# EAGLE schematic radio (EAGLE 7.5.0)
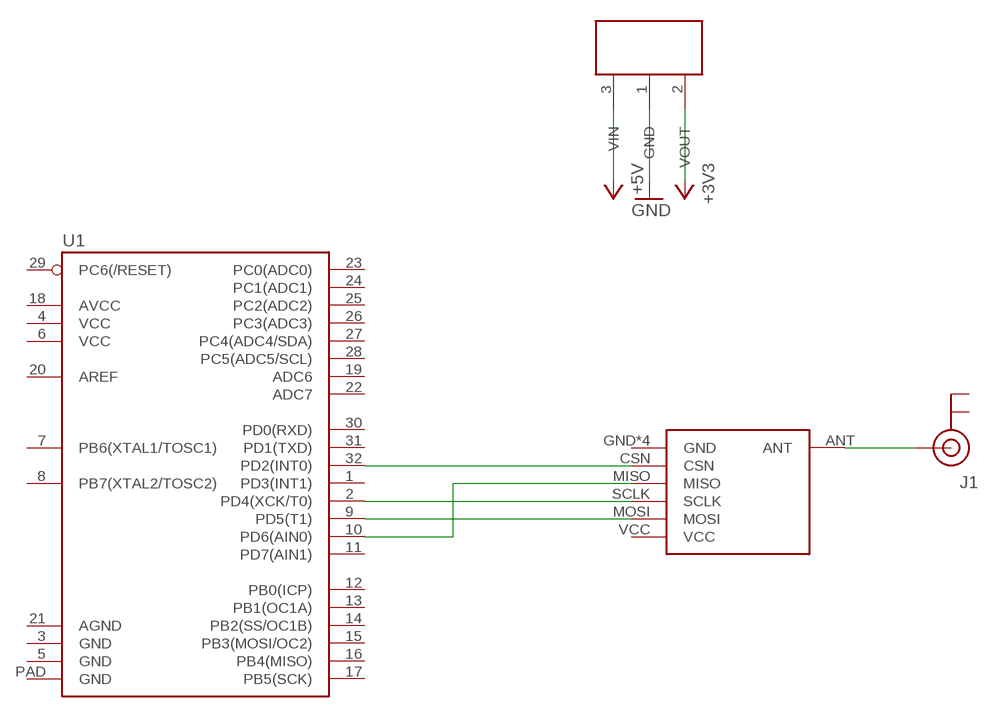
[diagram p0: schematic, sheet 1]

## Parts
J1  U.FL  [U.FL]
U1  ATMEGA328P_MLFMLF32  [MLF32-PAD]
U$1  CC2500-NOANT  [CC2500-SMD]
U$2  662K  [SOT-23]

## Nets
N$1: U1.2(PD4(XCK/T0)) U$1.SCLK
N$2: U1.32(PD2(INT0)) U$1.CSN
N$3: U1.9(PD5(T1)) U$1.MOSI
N$4: U1.10(PD6(AIN0)) U$1.MISO
N$5: J1.P$3(SIGNAL) U$1.ANT
Unconnected: J1.P$1(GND) J1.P$2(GND) U1.1(PD3(INT1)) U1.3(GND) U1.4(VCC) U1.5(GND) U1.6(VCC) U1.7(PB6(XTAL1/TOSC1)) U1.8(PB7(XTAL2/TOSC2)) U1.11(PD7(AIN1)) U1.12(PB0(ICP)) U1.13(PB1(OC1A)) U1.14(PB2(SS/OC1B)) U1.15(PB3(MOSI/OC2)) U1.16(PB4(MISO)) U1.17(PB5(SCK)) U1.18(AVCC) U1.19(ADC6) U1.20(AREF) U1.21(AGND) U1.22(ADC7) U1.23(PC0(ADC0)) U1.24(PC1(ADC1)) U1.25(PC2(ADC2)) U1.26(PC3(ADC3)) U1.27(PC4(ADC4/SDA)) U1.28(PC5(ADC5/SCL)) U1.29(PC6(/RESET)) U1.30(PD0(RXD)) U1.31(PD1(TXD)) U1.PAD(GND) U$1.GND U$1.GND@1(GND) U$1.GND@2(GND) U$1.GND@3(GND) U$1.VCC U$2.1(GND) U$2.2(VOUT) U$2.3(VIN)

## Library data of the parts
J1 = SparkFun-Connectors:U.FL: SMD antenna connector- WRL-09144; PROD_ID: CONN-09193
U1 = SparkFun-DigitalIC:ATMEGA328P_MLF: 32-Pin Atmega328 part Commonly used on Arduino compatible boards Available in QFP and QFN packages TQFP is IC-09069 QFN is non-stock
U$1 = dsal:CC2500-NOANT
U$2 = dsal:662K: 3v3 regulator Maximum input of 5V. Wants 1µF cap between VIN and ground and another between VOUT and ground.